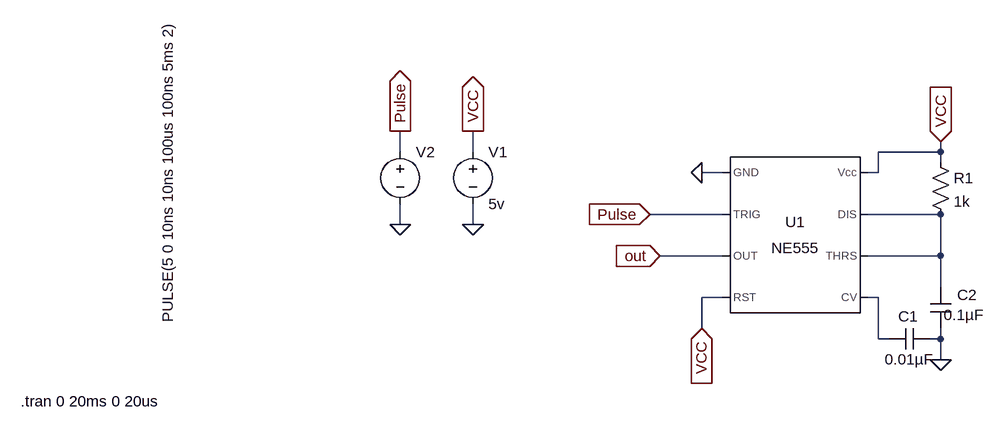
[diagram p0: schematic Draft2.asc]
Draft2.asc, the LTspice schematic file:
Version 4.1
SHEET 1 880 680
WIRE -400 48 -400 16
WIRE -288 48 -288 16
WIRE 432 48 432 32
WIRE 432 48 336 48
WIRE 432 64 432 48
WIRE 96 80 64 80
WIRE 336 80 336 48
WIRE 336 80 320 80
WIRE 96 144 -16 144
WIRE 432 144 320 144
WIRE -400 160 -400 128
WIRE -288 160 -288 128
WIRE 96 208 0 208
WIRE 432 208 432 144
WIRE 432 208 320 208
WIRE 432 256 432 208
WIRE 96 272 64 272
WIRE 336 272 320 272
WIRE 64 320 64 272
WIRE 336 336 336 272
WIRE 352 336 336 336
WIRE 432 336 432 320
WIRE 432 336 416 336
WIRE 432 368 432 336
FLAG -288 160 0
FLAG -288 16 VCC
IOPIN -288 16 Out
FLAG 432 32 VCC
IOPIN 432 32 In
FLAG 64 320 VCC
IOPIN 64 320 In
FLAG 432 368 0
FLAG -400 160 0
FLAG -400 16 Pulse
IOPIN -400 16 Out
FLAG -16 144 Pulse
IOPIN -16 144 In
FLAG 0 208 out
IOPIN 0 208 In
FLAG 64 80 0
SYMBOL Misc\\NE555 208 176 R0
SYMATTR InstName U1
SYMBOL voltage -288 32 R0
WINDOW 123 0 0 Left 0
WINDOW 39 0 0 Left 0
SYMATTR InstName V1
SYMATTR Value 5v
SYMBOL cap 416 320 R90
WINDOW 0 -3 34 VBottom 2
WINDOW 3 32 32 VTop 2
SYMATTR InstName C1
SYMATTR Value 0.01µF
SYMBOL cap 448 320 R180
WINDOW 0 -40 52 Left 2
WINDOW 3 -51 21 Left 2
SYMATTR InstName C2
SYMATTR Value 0.1µF
SYMBOL res 416 48 R0
SYMATTR InstName R1
SYMATTR Value 1k
SYMBOL voltage -400 32 R0
WINDOW 3 -358 279 VLeft 2
WINDOW 123 0 0 Left 0
WINDOW 39 0 0 Left 0
SYMATTR InstName V2
SYMATTR Value PULSE(5 0 10ns 10ns 100us 100ns 5ms 2)
TEXT -984 432 Left 2 !.tran 0 20ms 0 20us

The netlist it stands for:
* Draft2.asc
X§U1 0 Pulse out VCC N002 N001 N001 VCC NE555  ; pins GND TRIG OUT RST CV THRS DIS Vcc
V1 VCC 0 5v
C1 0 N002 0.01µF
C2 0 N001 0.1µF
R1 VCC N001 1k
V2 Pulse 0 PULSE(5 0 10ns 10ns 100us 100ns 5ms 2)
.tran 0 20ms 0 20us
.lib NE555.sub
.backanno
.end